# EAGLE schematic local_osc (EAGLE 6.5.0)
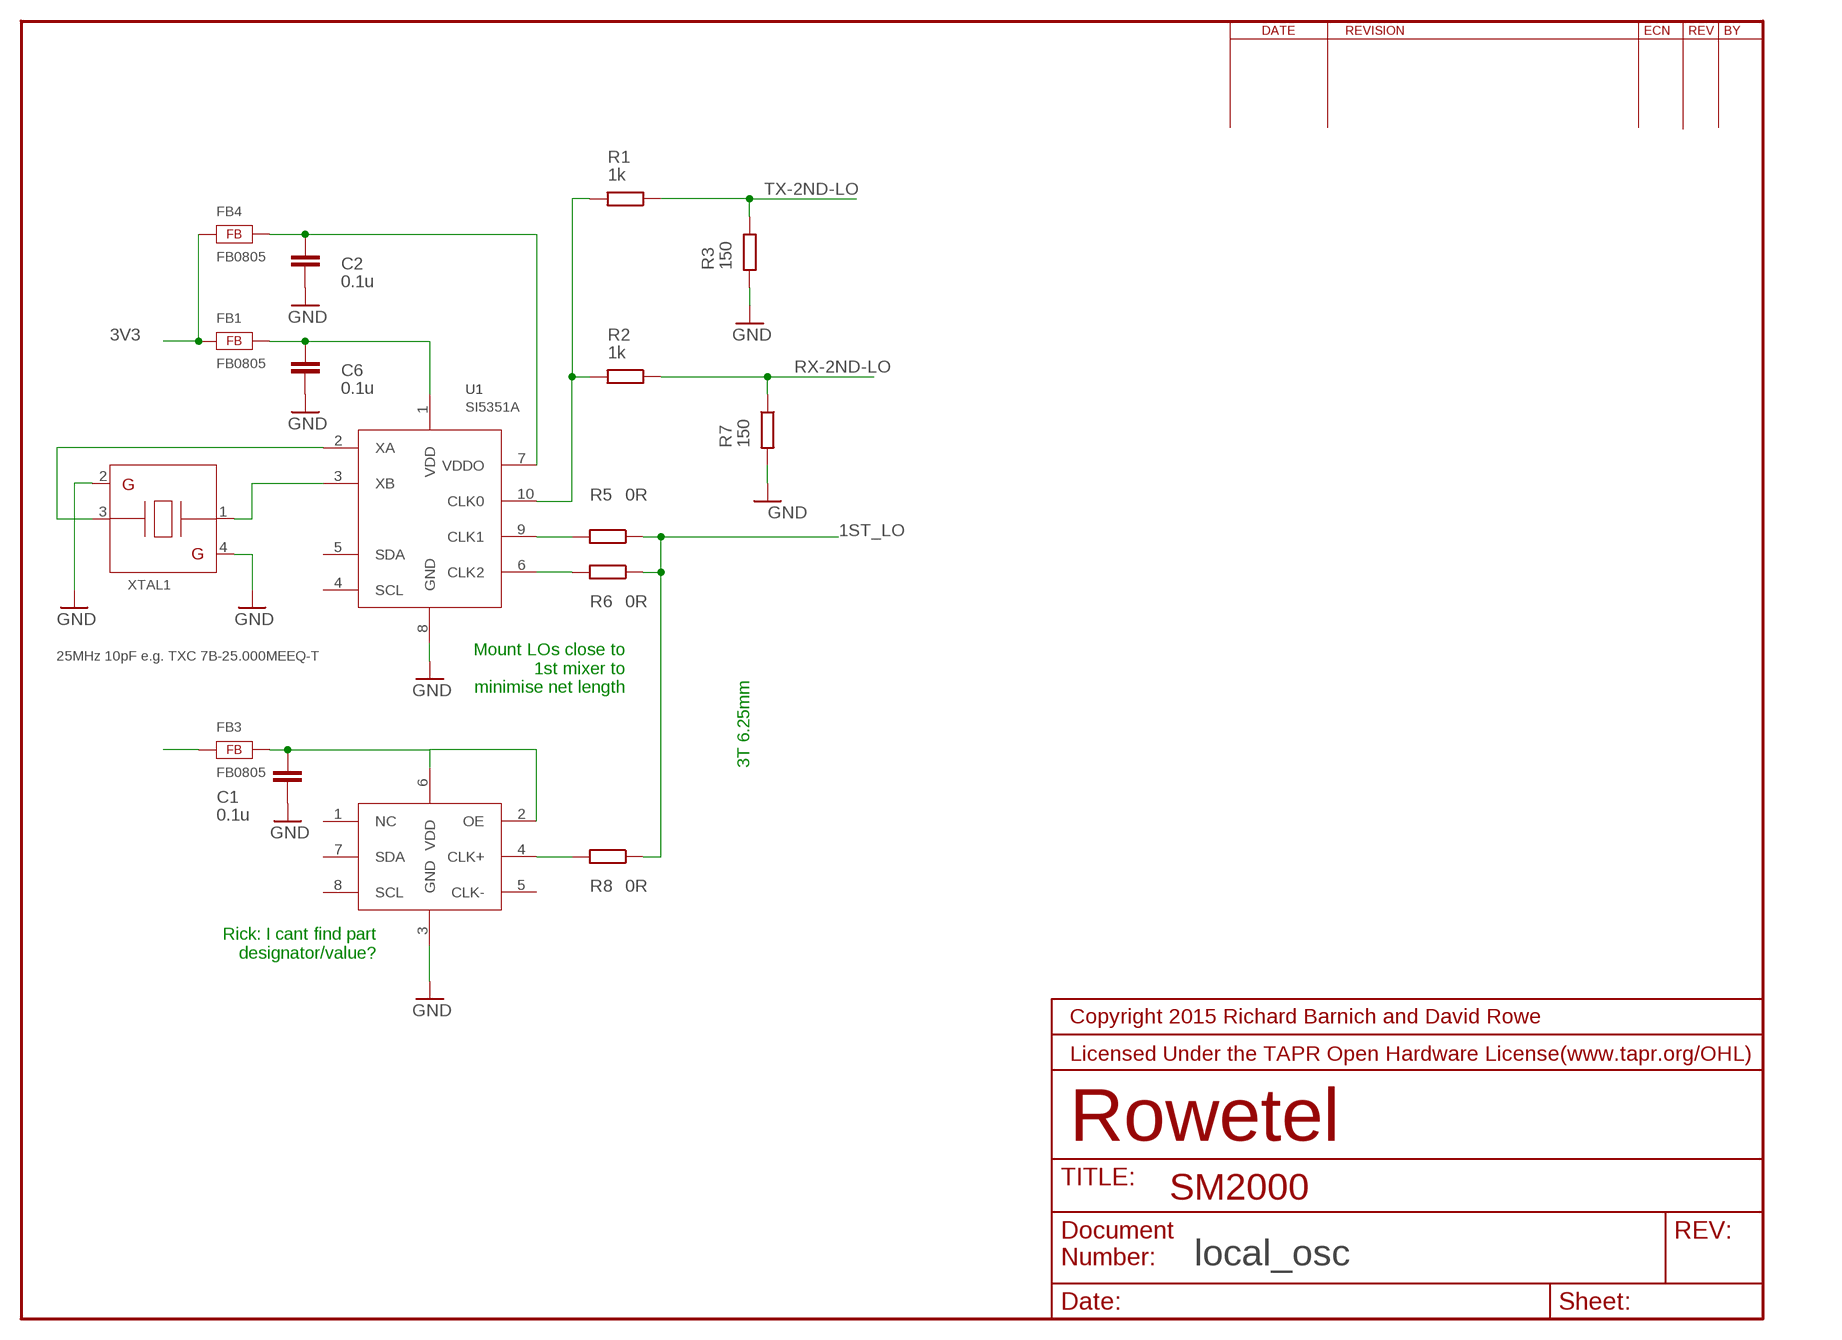
[diagram p0: schematic, sheet 1]

## Parts
C1  0.1u  C-EU025-024X044  [C025-024X044]
C2  0.1u  C-EU025-024X044  [C025-024X044]
C6  0.1u  C-EU025-024X044  [C025-024X044]
FB1  FB0805  [FE0805]
FB3  FB0805  [FE0805]
FB4  FB0805  [FE0805]
R1  1k  RESISTOR_0805  [RESC2012X70N]
R2  1k  RESISTOR_0805  [RESC2012X70N]
R3  150  RESISTOR_0805  [RESC2012X70N]
R5  0R  RESISTOR_0805  [RESC2012X70N]
R6  0R  RESISTOR_0805  [RESC2012X70N]
R7  150  RESISTOR_0805  [RESC2012X70N]
R8  0R  RESISTOR_0805  [RESC2012X70N]
U1  SI5351A  [MSOP10]
U2  SI570CAC000141DG  SI570  [SI570]
XTAL1  25MHz 10pF e.g. TXC 7B-25.000MEEQ-T  XTAL-FY0800035  [XTAL-FY0800035]

## Nets
1ST_LO: R5.1 R6.1 R8.1
3V3: FB1.1 FB4.1
GND: C1.2 C2.2 C6.2 R3.2 R7.2 U1.8(GND) U2.3(GND) XTAL1.2 XTAL1.4
N$1: C6.1 FB1.2 U1.1(VDD)
N$2: U1.2(XA) XTAL1.3
N$3: U1.3(XB) XTAL1.1
N$4: FB3.1
N$5: C1.1 FB3.2 U2.2(OE) U2.6(VDD)
N$6: C2.1 FB4.2 U1.7(VDDO)
N$8: R5.2 U1.9(CLK1)
N$9: R6.2 U1.6(CLK2)
N$10: R8.2 U2.4(CLK+)
N$11: R1.2 R2.2 U1.10(CLK0)
RX-2ND-LO: R2.1 R7.1
TX-2ND-LO: R1.1 R3.1
Unconnected: U1.4(SCL) U1.5(SDA) U2.1(NC) U2.5(CLK-) U2.7(SDA) U2.8(SCL)

## Notes on the sheet
- Mount LOs close to
  1st mixer to
  minimise net length
- 3T 6.25mm
- Rick: I cant find part
  designator/value?
- SM2000

## Library data of the parts
C1 C2 C6 = rcl:C-EU: CAPACITOR, European symbol
FB1 FB3 FB4 = _RoweTel:FB0805
R1-R3 R5-R8 = AA-ipc-7351-resistor:RESISTOR_
U1 = _RoweTel:SI5351A
U2 = _RoweTel:SI570
XTAL1 = _RoweTel:XTAL-FY0800035